# EAGLE design Integrated Board v1 (EAGLE 6.2)
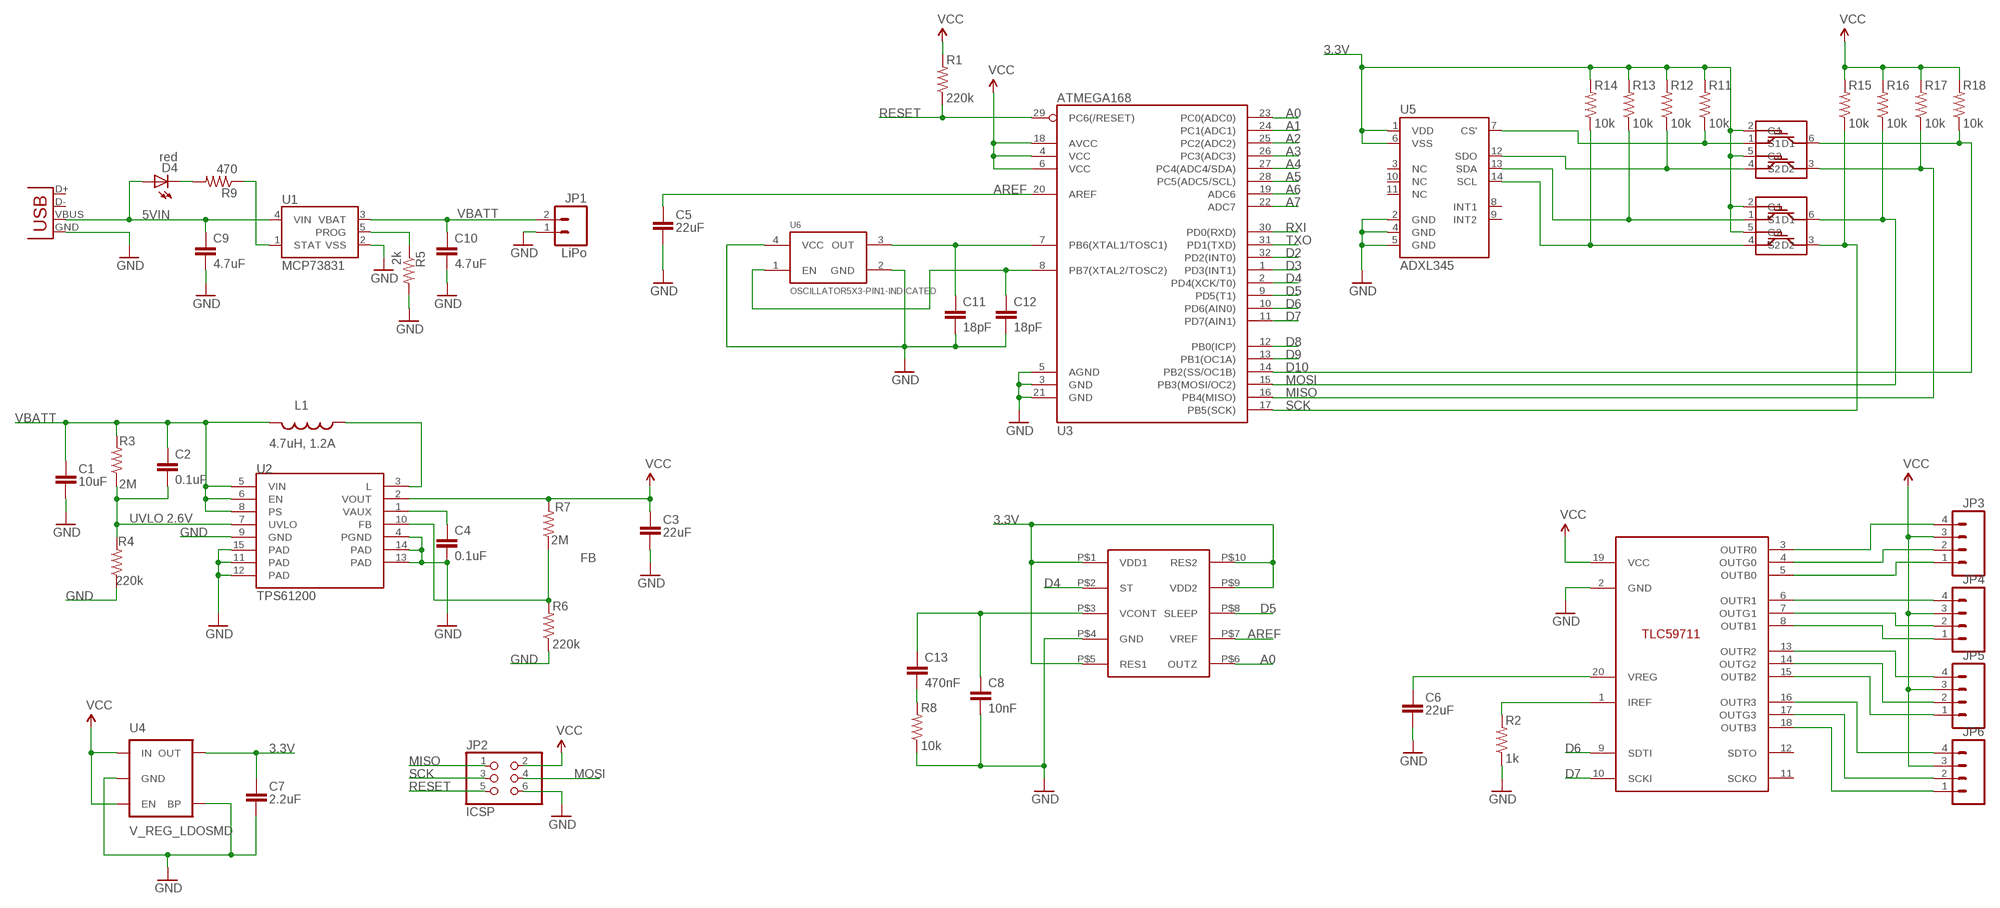
[diagram p0: schematic, sheet 1]

## Parts
C1  10uF  CAP0603  [0603]
C2  0.1uF  CAP0603-CAP  [0603-CAP]
C3  22uF  CAP0805  [0805]
C4  0.1uF  CAP0603-CAP  [0603-CAP]
C5  22uF  CAP0805  [0805]
C6  22uF  CAP0805  [0805]
C7  2.2uF  CAP0603  [0603]
C8  10nF  CAP0603-CAP  [0603-CAP]
C9  4.7uF  CAP0603-CAP  [0603-CAP]
C10  4.7uF  CAP0603-CAP  [0603-CAP]
C11  18pF  CAP0603-CAP  [0603-CAP]
C12  18pF  CAP0603-CAP  [0603-CAP]
C13  470nF  CAP0603-CAP  [0603-CAP]
D4  red  LED0603  [LED-0603]
JP1  LiPo  M02-JST-2MM-SMT  [JST-2-SMD]
JP2  ICSP  PINHD-2X3  [2X03]
JP3  M04PTH  [1X04]
JP4  M04PTH  [1X04]
JP5  M04PTH  [1X04]
JP6  M04PTH  [1X04]
L1  4.7uH, 1.2A  INDUCTOR.  [CDRH2D09]
R1  220k  RESISTOR0603-RES  [0603-RES]
R2  1k  RESISTOR0603-RES  [0603-RES]
R3  2M  RESISTOR0603-RES  [0603-RES]
R4  220k  RESISTOR0603-RES  [0603-RES]
R5  2k  RESISTOR0603-RES  [0603-RES]
R6  220k  RESISTOR0603-RES  [0603-RES]
R7  2M  RESISTOR0603-RES  [0603-RES]
R8  10k  RESISTOR0603-RES  [0603-RES]
R9  470  RESISTOR0603-RES  [0603-RES]
R11  10k  RESISTOR0603-RES  [0603-RES]
R12  10k  RESISTOR0603-RES  [0603-RES]
R13  10k  RESISTOR0603-RES  [0603-RES]
R14  10k  RESISTOR0603-RES  [0603-RES]
R15  10k  RESISTOR0603-RES  [0603-RES]
R16  10k  RESISTOR0603-RES  [0603-RES]
R17  10k  RESISTOR0603-RES  [0603-RES]
R18  10k  RESISTOR0603-RES  [0603-RES]
U1  MCP73831  [SOT23-5]
U2  TPS61200  [QFN-10_PAD]
U3  ATMEGA168  [TQFP32-08]
U4  V_REG_LDOSMD  [SOT23-5]
U5  ADXL345  [LGA14]
U6  OSCILLATOR5X3-PIN1-INDICATED  [CRYSTAL-OSC-SMD-5X3]
U$1  TLC59711  [TSSOP20]
U$2  2N7002DW  [SOT363]
U$3  2N7002DW  [SOT363]
U$4  LY3100ALH  [LGA10]
X1  USB-MICROB  [USB-MICROB]

## Nets
3.3V: C7.1 R11.2 R12.2 R13.2 R14.2 U4.5(OUT) U5.1(VDD) U5.6(VSS) U$2.2(G1) U$2.5(G2) U$3.2(G1) U$3.5(G2) U$4.P$1(VDD1) U$4.P$5(RES1) U$4.P$9(VDD2) U$4.P$10(RES2)
5VIN: C9.1 D4.A U1.4(VIN) X1.VBUS
A0: U3.23(PC0(ADC0)) U$4.P$6(OUTZ)
A1: U3.24(PC1(ADC1))
A2: U3.25(PC2(ADC2))
A3: U3.26(PC3(ADC3))
A4: U3.27(PC4(ADC4/SDA))
A5: U3.28(PC5(ADC5/SCL))
A6: U3.19(ADC6)
A7: U3.22(ADC7)
AREF: C5.1 U3.20(AREF) U$4.P$7(VREF)
D2: U3.32(PD2(INT0))
D3: U3.1(PD3(INT1))
D4: U3.2(PD4(XCK/T0)) U$4.P$2(ST)
D5: U3.9(PD5(T1)) U$4.P$8(SLEEP)
D6: U3.10(PD6(AIN0)) U$1.9(SDTI)
D7: U3.11(PD7(AIN1)) U$1.10(SCKI)
D8: U3.12(PB0(ICP))
D9: U3.13(PB1(OC1A))
D10: R18.1 U3.14(PB2(SS/OC1B)) U$2.6(D1)
FB: R6.2 R7.1 U2.10(FB)
GND: C1.2 C3.2 C4.2 C5.2 C6.2 C7.2 C8.2 C9.2 C10.2 C11.2 C12.2 JP1.1 JP2.6 R2.1 R4.1 R5.2 R6.1 R8.1 U1.2(VSS) U2.4(PGND) U2.9(GND) U2.11(PAD) U2.12(PAD) U2.13(PAD) U2.14(PAD) U2.15(PAD) U3.3(GND) U3.5(AGND) U3.21(GND) U4.2(GND) U4.4(BP) U5.2(GND) U5.4(GND) U5.5(GND) U6.2(GND) U6.4(VCC) U$1.2(GND) U$4.P$4(GND) X1.GND
MISO: JP2.1 R17.1 U3.16(PB4(MISO)) U$2.3(D2)
MOSI: JP2.4 R16.1 U3.15(PB3(MOSI/OC2)) U$3.6(D1)
N$1: C4.1 U2.1(VAUX)
N$2: L1.P$1 U2.3(L)
N$3: C11.1 U3.7(PB6(XTAL1/TOSC1)) U6.3(OUT)
N$5: C13.2 R8.2
N$6: C6.1 U$1.20(VREG)
N$7: R2.2 U$1.1(IREF)
N$8: D4.C R9.2
N$10: R11.1 U5.7(CS') U$2.1(S1)
N$11: R5.1 U1.5(PROG)
N$12: R12.1 U5.12(SDO) U$2.4(S2)
N$13: R13.1 U5.13(SDA) U$3.1(S1)
N$14: R9.1 U1.1(STAT)
N$15: R14.1 U5.14(SCL) U$3.4(S2)
N$16: JP4.4(B) U$1.6(OUTR1)
N$17: JP4.2(R) U$1.7(OUTG1)
N$18: JP4.1(COM) U$1.8(OUTB1)
N$19: JP5.4(B) U$1.13(OUTR2)
N$20: JP5.2(R) U$1.14(OUTG2)
N$21: JP5.1(COM) U$1.15(OUTB2)
N$22: JP6.4(B) U$1.16(OUTR3)
N$23: JP6.2(R) U$1.17(OUTG3)
N$24: JP6.1(COM) U$1.18(OUTB3)
N$25: JP3.1(COM) U$1.5(OUTB0)
N$26: JP3.2(R) U$1.4(OUTG0)
N$27: JP3.4(B) U$1.3(OUTR0)
N$28: C12.1 U3.8(PB7(XTAL2/TOSC2)) U6.1(EN)
N$30: C8.1 C13.1 U$4.P$3(VCONT)
RESET: JP2.5 R1.1 U3.29(PC6(/RESET))
RXI: U3.30(PD0(RXD))
SCK: JP2.3 R15.1 U3.17(PB5(SCK)) U$3.3(D2)
TXO: U3.31(PD1(TXD))
UVLO: C2.2 R3.1 R4.2 U2.7(UVLO)
VBATT: C1.1 C2.1 C10.1 JP1.2 L1.P$2 R3.2 U1.3(VBAT) U2.5(VIN) U2.6(EN) U2.8(PS)
VCC: C3.1 JP2.2 JP3.3(G) JP4.3(G) JP5.3(G) JP6.3(G) R1.2 R7.2 R15.2 R16.2 R17.2 R18.2 U2.2(VOUT) U3.4(VCC) U3.6(VCC) U3.18(AVCC) U4.1(IN) U4.3(EN) U$1.19(VCC)
Unconnected: U5.3(NC) U5.8(INT1) U5.9(INT2) U5.10(NC) U5.11(NC) U$1.11(SCKO) U$1.12(SDTO) X1.D+ X1.D-

## Notes on the sheet
- UVLO 2.6V

## Library data of the parts
C1 C3 C5-C7 = CH_passive:CAP: Capacitor Standard 0603 ceramic capacitor, and 0.1" leaded capacitor.
C2 C4 C8-C13 = SparkFun:CAP: Capacitor Standard 0603 ceramic capacitor, and 0.1" leaded capacitor.
D4 = SparkFun:LED: LEDs Standard schematic elements and footprints for 5mm, 3mm, 1206, and 0603 sized LEDs. 5mm - Spark Fun Electronics SKU : COM-00529 (and others)
JP1 = SparkFun:M02: Header 2 Standard 2-pin 0.1" header. Use with straight break away headers (SKU : PRT-00116), right angle break away headers (PRT-00553), swiss pins (PRT-00743), machine pins (PRT-00117), and female headers (PRT-00115). Molex polarized connector foot print use with SKU : PRT-08233 with associated crimp pins and housings.
JP2 = SparkFun:PINHD-2X3: PIN HEADER
JP3-JP6 = SparkFun:M04: Header 4 Standard 4-pin 0.1" header. Use with straight break away headers (SKU : PRT-00116), right angle break away headers (PRT-00553), swiss pins (PRT-00743), machine pins (PRT-00117), and female headers (PRT-00115). Molex polarized connector foot print use with SKU : PRT-08231 with associated crimp pins and housings. 1MM SMD Version SKU: PRT-10208
L1 = SparkFun:INDUCTOR: Inductors Basic Inductor/Choke - 0603 and 1206. Footprints are not proven and vary greatly between part numbers.
R1-R9 R11-R18 = SparkFun:RESISTOR: Resistor Basic schematic elements and footprints for 0603, 1206, and PTH resistors.
U1 = SparkFun:MCP73831: Microchip's MCP73831 Miniature single cell, fully integrated Li-Ion, Li-polymer charge management controller http://ww1.microchip.com/downloads/en/DeviceDoc/21984a.pdf
U2 = SparkFun:TPS61200: DC to DC Booster
U3 = SparkFun:ATMEGA168
U4 = SparkFun:V_REG_LDO: Voltage Regulator LDO Standard 150mA LDO voltage regulator in SOT-23 layout. Micrel part MIC5205. BP (by-pass) pin is used to lower output noise with 470pF cap.
U5 = SparkFun:ADXL345
U6 = SparkFun:OSCILLATOR
U$1 = SparkFun:TLC59711: TLC59711 RGB LED controller
U$2 U$3 = SparkFun:2N7002DW
U$4 = SparkFun:LY3100ALH
X1 = SparkFun:USB: USB Connectors USB-B-PTH is fully proven SKU : PRT-00139 USB-miniB is fully proven SKU : PRT-00587 USB-A-PCB is untested. USB-A-H is throughly reviewed, but untested. Spark Fun Electronics SKU : PRT-00437 USB-B-SMT is throughly reviewed, but untested. Needs silkscreen touching up. USB-A-S has not been used/tested USB-MB-H has not been used/tested

## Net classes
0 default: width 0.203 mm
1 vcc: width 0.254 mm

## Board
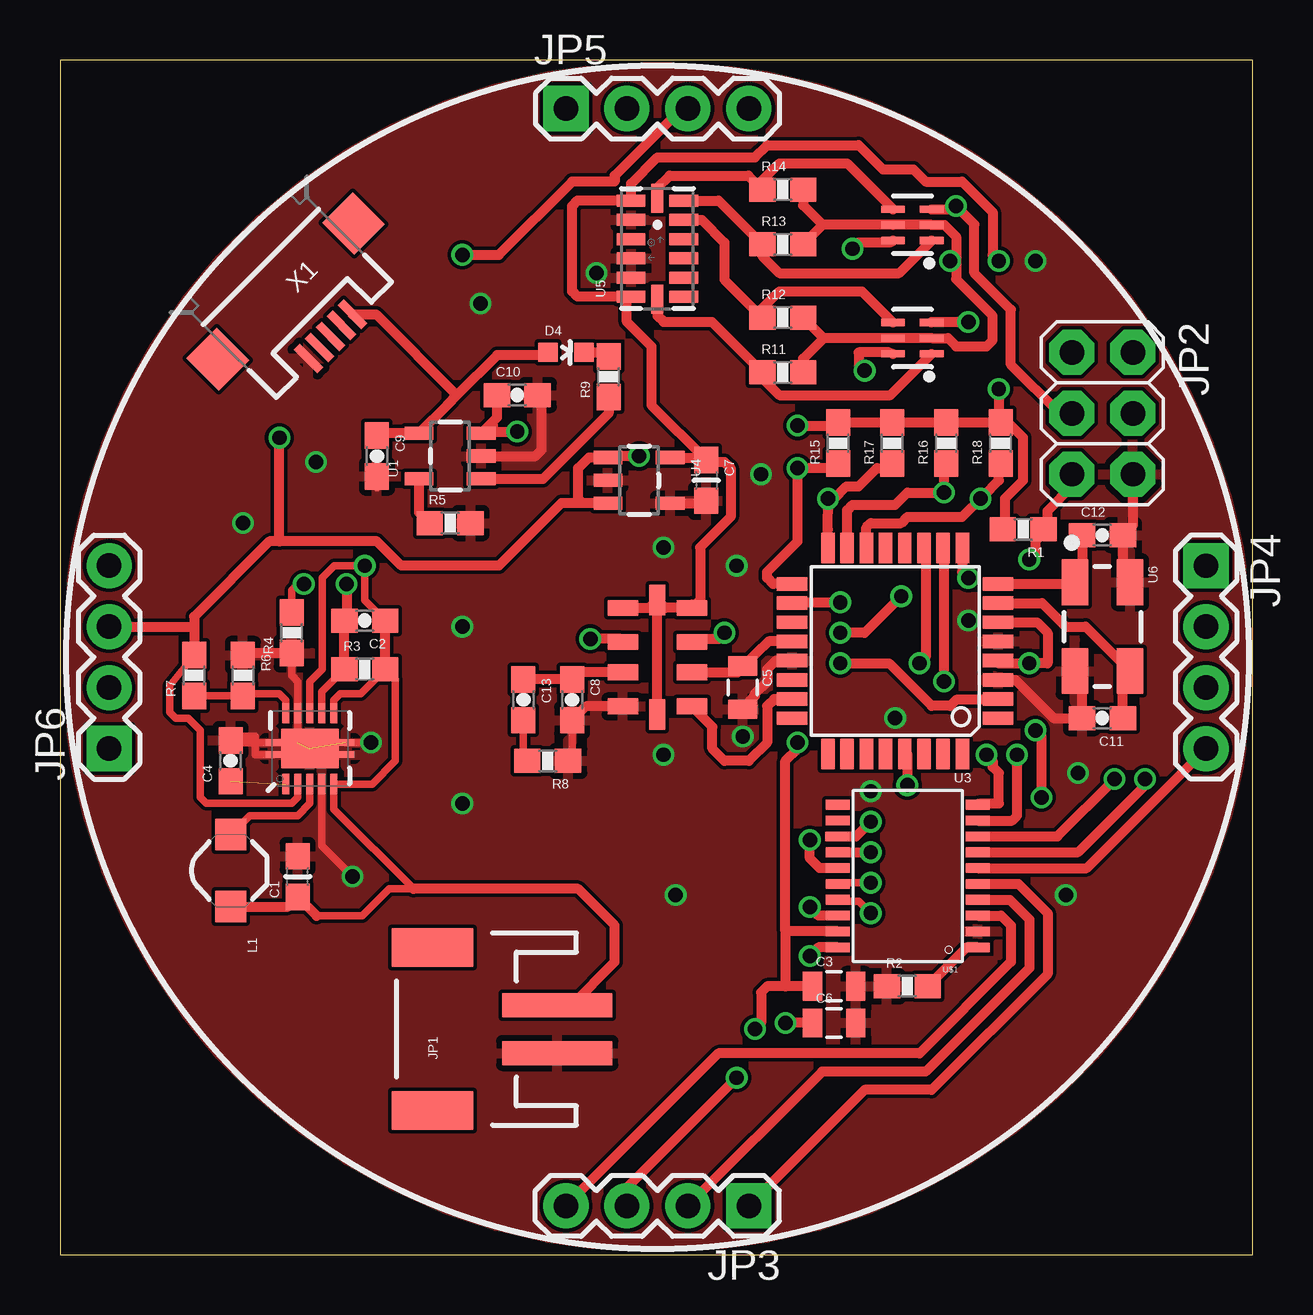
[diagram p1: board, top side]
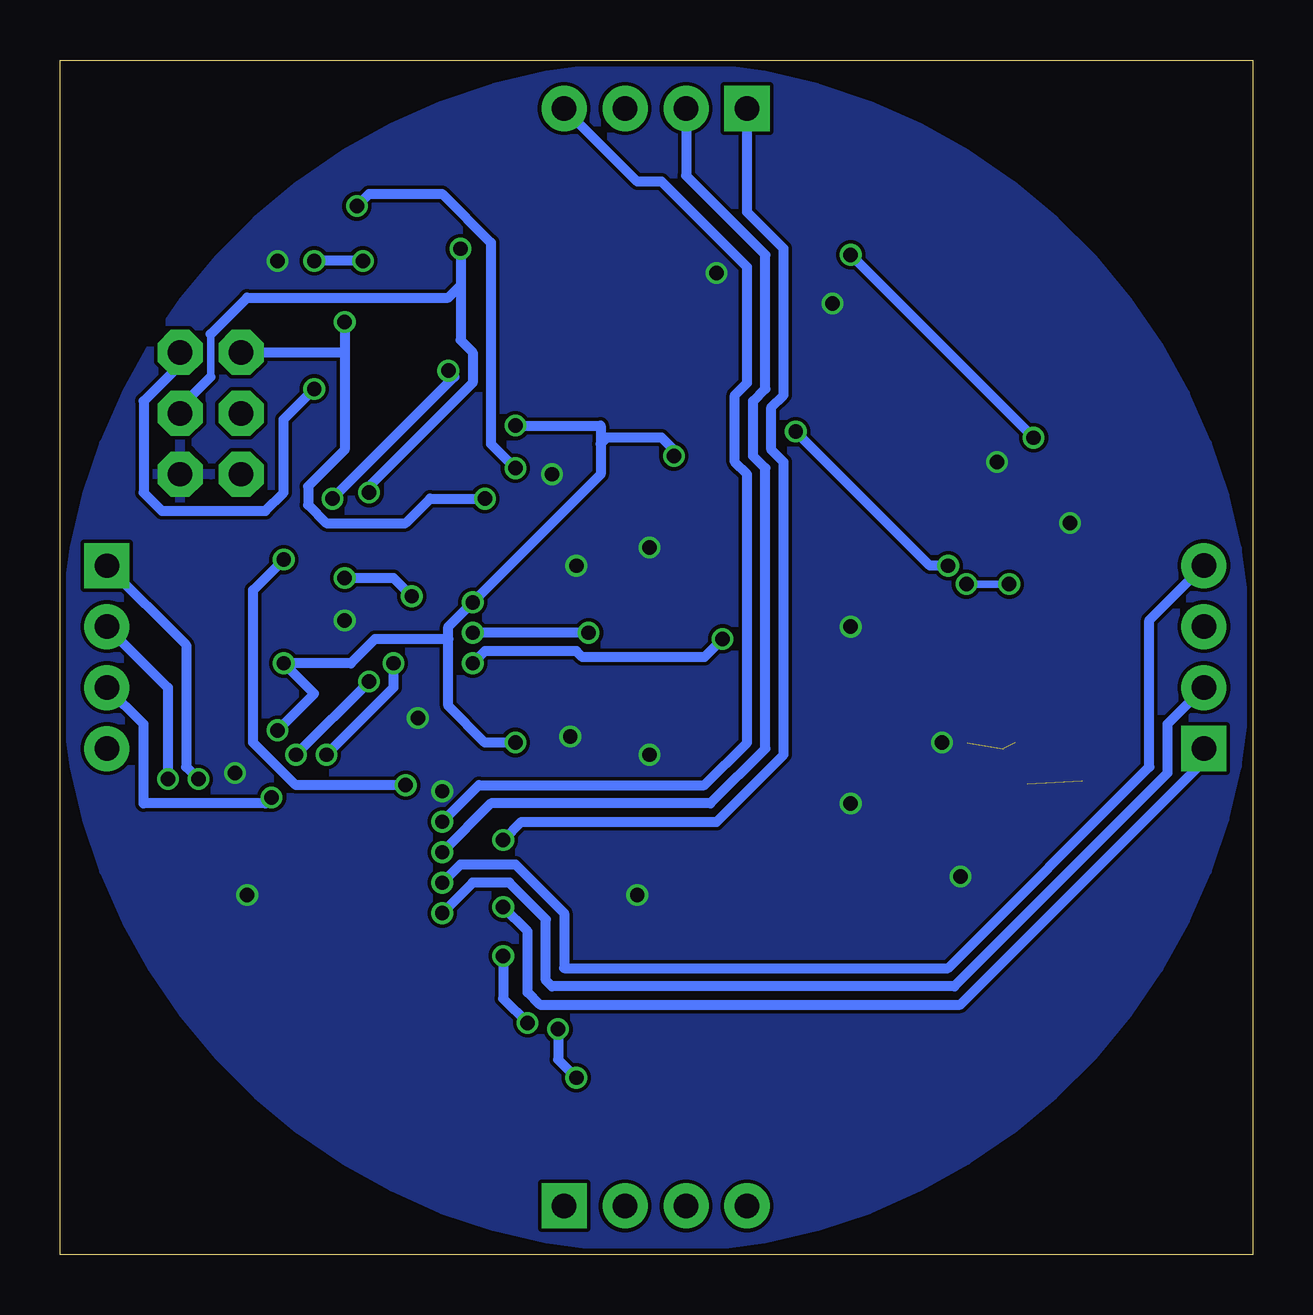
[diagram p2: board, bottom side, seen from below]

Size 49.71 x 49.77 mm. Coordinates in mm from the lower left corner, seen from the top.
Outline: 0,0 49.71,0 49.71,49.77 0,49.77 0,0
Copper layers (1*16): Top 0.035mm / dielectric 1.5mm / Bottom 0.035mm
Design rules: minimum track width 6mil, minimum drill 12mil, track to track 6mil, track to pad 6mil, pad to pad 6mil, via to via 6mil, smd to smd 0mil, copper to edge 10mil, drill to drill 10mil, minimum pad ring 10mil, minimum via ring 6mil, stop-mask expansion 2mil, vias tented up to drill 100mil, thermal gap 10mil

### Footprints (pad centres in the part's own frame; a part is rotated, then mirrored left to right if it is on the bottom)
0603 = smd 1.1 x 1: 1 -0.85,0; 2 0.85,0
0603-CAP = smd 1.1 x 1: 1 -0.85,0; 2 0.85,0
0805 = smd 0.8 x 1.2: 1 -0.9,0; 2 0.9,0
LED-0603 = smd 0.8 x 0.8: A 0,-0.75; C 0,0.75
JST-2-SMD = smd 1 x 4.6: 1 -1,-3.7; 2 1,-3.7 | smd 1.6 x 3.4: NC1 -3.4,1.5; NC2 3.4,1.5
2X03 = drill 1.016 pad 1.88 octagon: 1 -2.54,-1.27; 2 -2.54,1.27; 3 0,-1.27; 4 0,1.27; 5 2.54,-1.27; 6 2.54,1.27
1X04 = drill 1.016 pad 1.88 square: 1 0,0 | drill 1.016 pad 1.88: 2 2.54,0; 3 5.08,0; 4 7.62,0
CDRH2D09 = smd 1.3 x 1.3: P$1 -1.5,0; P$2 1.5,0
0603-RES = smd 1.1 x 1: 1 -0.85,0; 2 0.85,0
SOT23-5 = smd 0.55 x 1.2: 1 -0.95,-1.3; 2 0,-1.3; 3 0.95,-1.3; 4 0.95,1.3; 5 -0.95,1.3
QFN-10_PAD = smd 0.297 x 0.85: 1 -1,-1.475; 2 -0.5,-1.475; 3 0,-1.475; 4 0.5,-1.475; 5 1,-1.475; 6 1,1.475; 7 0.5,1.475; 8 0,1.475; 9 -0.5,1.475; 10 -1,1.475 | smd 0.7 x 0.28: 11 -1.5,0.25; 12 -1.5,-0.25; 13 1.5,0.25; 14 1.5,-0.25 | smd 2.4 x 1.65: 15 0,0
TQFP32-08 = smd 1.27 x 0.559: 1 -4.293,2.8; 2 -4.293,2; 3 -4.293,1.2; 4 -4.293,0.4; 5 -4.293,-0.4; 6 -4.293,-1.2; 7 -4.293,-2; 8 -4.293,-2.8; 17 4.293,-2.8; 18 4.293,-2; 19 4.293,-1.2; 20 4.293,-0.4; 21 4.293,0.4; 22 4.293,1.2; 23 4.293,2; 24 4.293,2.8 | smd 0.559 x 1.27: 9 -2.8,-4.293; 10 -2,-4.293; 11 -1.2,-4.293; 12 -0.4,-4.293; 13 0.4,-4.293; 14 1.2,-4.293; 15 2,-4.293; 16 2.8,-4.293; 25 2.8,4.293; 26 2,4.293; 27 1.2,4.293; 28 0.4,4.293; 29 -0.4,4.293; 30 -1.2,4.293; 31 -2,4.293; 32 -2.8,4.293
LGA14 = smd 0.5 x 1.2: 1 2,1.1; 2 1.2,1.1; 3 0.4,1.1; 4 -0.4,1.1; 5 -1.2,1.1; 6 -2,1.1; 8 -2,-1.1; 9 -1.2,-1.1; 10 -0.4,-1.1; 11 0.4,-1.1; 12 1.2,-1.1; 13 2,-1.1 | smd 1.2 x 0.5: 7 -2.1,0; 14 2.1,0
CRYSTAL-OSC-SMD-5X3 = smd 1.9 x 1.1: 1 -1.85,-1.15; 2 1.85,-1.15; 3 1.85,1.15; 4 -1.85,1.15
TSSOP20 = smd 1 x 0.4: 1 -2.937,2.693; 2 -2.937,2.032; 3 -2.937,1.372; 4 -2.937,0.712; 5 -2.937,0.051; 6 -2.937,-0.609; 7 -2.937,-1.27; 8 -2.943,-1.93; 9 -2.937,-2.59; 10 -2.937,-3.251; 11 2.905,-3.251; 12 2.905,-2.59; 13 2.911,-1.93; 14 2.905,-1.27; 15 2.905,-0.609; 16 2.905,0.051; 17 2.905,0.712; 18 2.905,1.372; 19 2.905,2.032; 20 2.905,2.693
SOT363 = smd 0.3 x 0.99: 1 -0.65,-0.8; 2 0,-0.8; 3 0.65,-0.8; 4 0.65,0.81; 5 0,0.81; 6 -0.65,0.81
LGA10 = smd 1.27 x 0.66: P$1 -1.435,2.05; P$2 -1.435,0.635; P$3 -1.435,-0.635; P$4 -1.435,-2.05; P$6 1.435,-2.05; P$7 1.435,-0.635; P$8 1.435,0.635; P$9 1.435,2.05 | smd 0.66 x 1.27: P$5 0,-2.385; P$10 0,2.385
USB-MICROB = smd 0.35 x 1.4: D+ 0,2.65; D- -0.65,2.65; GND 1.3,2.65; ID 0.65,2.65; VBUS -1.3,2.65 | smd 1.8 x 1.9: MT1 -4,0; MT2 4,0

### Placement (x,y rotation side)
C1  9.91,15.75 90 top
C2  12.7,26.42 180 top
C3  32.26,11.18 0 top
C4  7.11,20.57 90 top
C5  28.45,23.62 270 top
C6  32.26,9.65 0 top
C7  26.92,32.26 270 top
C8  21.34,23.11 270 top
C9  13.21,33.27 270 top
C10  19.05,35.81 0 top
C11  43.43,22.35 180 top
C12  43.43,29.97 0 top
C13  19.3,23.11 270 top
D4  21.08,37.59 270 top
JP1  17.02,9.4 90 top
JP2  43.43,35.05 270 top
JP3  28.7,2.03 180 top
JP4  47.75,28.7 270 top
JP5  21.08,47.75 0 top
JP6  2.04,21.09 90 top
L1  7.11,16 270 top
R1  40.13,30.23 180 top
R2  35.31,11.18 0 top
R3  12.7,24.38 0 top
R4  9.65,25.91 90 top
R5  16.26,30.48 0 top
R6  7.62,24.13 270 top
R7  5.59,24.13 90 top
R8  20.32,20.57 180 top
R9  22.86,36.58 90 top
R11  30.12,36.75 0 top
R12  30.12,39.04 0 top
R13  30.12,42.09 0 top
R14  30.12,44.37 0 top
R15  32.43,33.81 90 top
R16  36.93,33.81 90 top
R17  34.68,33.81 90 top
R18  39.19,33.81 90 top
U1  16.26,33.27 90 top
U2  10.41,21.08 0 top
U3  34.8,25.15 180 top
U4  24.13,32.26 270 top
U5  24.89,41.91 90 top
U6  43.43,26.16 270 top
U$1  35.31,15.49 180 top
U$2  35.52,38.18 90 top
U$3  35.52,42.9 90 top
U$4  24.89,24.89 0 top
X1  9.4,40.13 225 top

### Tracks (layer width: path | path; a pad name or v marks a point on that pad's centre or on a via)
3.3V  (via drill 0.6)
  Top 0.406: 31.78,42.9 U$3.5 U$3.2 36.85,42.9 37.34,42.42 37.34,41.4 | 31.78,42.9 R13.2 | R14.2 30.97,43.72 31.78,42.9 | 31.82,38.18 U$2.5 U$2.2 37,38.18 37.34,37.85 38.61,37.85 38.86,38.1 38.86,39.12 37.34,40.64 37.34,41.4 | 31.82,38.18 R12.2 | R11.2 30.97,37.33 31.82,38.18 | U$4.P$9 25.23,26.94 U$4.P$10 | U$4.P$1 24.56,26.94 U$4.P$10 | U$4.P$5 U$4.P$10 | U4.5 26.82,33.21 C7.1 | U$4.P$9 26.33,27.09 | C7.1 27.01,33.02 27.69,33.02 27.94,32.77 27.94,30.73 26.67,29.46 26.67,27.29 U$4.P$9 | v39.12,41.4 38.86,41.66 38.86,43.43 37.59,44.7 36.07,44.7 35.56,45.21 34.29,45.21 33.27,46.23 29.46,46.23 28.96,45.72 24.89,45.72 23.79,44.62 U5.1 21.56,43.91 21.34,43.69 21.34,40.13 21.56,39.91 U5.6 23.62,39.74 23.62,38.86 24.64,37.85 24.64,35.39 C7.1 | 37.34,41.4 v37.08,41.4
  Bottom 0.406: v37.08,41.4 v39.12,41.4
5VIN
  Top 0.406: 16.54,35.81 16.15,35.41 U1.4 13.31,34.22 C9.1 | D4.A 20.22,37.48 18.21,37.48 16.54,35.81 | X1.VBUS 13.17,39.18 16.54,35.81
A0
  Top 0.406: U3.23 29.75,23.15 29.46,22.86 29.46,21.34 28.7,20.57 27.69,20.57 27.18,21.08 27.18,21.99 U$4.P$6
AREF
  Top 0.406: U$4.P$7 28.23,24.26 C5.1 29.52,25.55 U3.20
D4  (via drill 0.6)
  Top 0.406: U3.2 38.86,23.11 37.34,23.11 37.08,22.86 36.32,22.86 34.54,24.64 v32.51,24.64 | v22.1,25.65 23.37,25.65 U$4.P$2
  Bottom 0.406: v32.51,24.64 32,25.15 28.19,25.15 27.94,24.89 22.86,24.89 v22.1,25.65
D5  (via drill 0.6)
  Top 0.406: v32.51,25.91 33.53,25.91 v35.05,27.43 | v37.85,28.19 37.59,28.45 37.59,29.21 U3.9 | v27.69,25.91 27.43,25.65 26.42,25.65 U$4.P$8
  Bottom 0.406: v35.05,27.43 35.81,28.19 v37.85,28.19 | v27.69,25.91 v32.51,25.91
D6  (via drill 0.6)
  Top 0.406: U3.10 36.83,29.21 v36.83,23.88 | U$1.9 39.67,18.08 39.88,18.29 v39.88,20.83
  Bottom 0.406: v36.83,23.88 v39.88,20.83
D7  (via drill 0.6)
  Top 0.406: U$1.10 38.35,18.8 39.12,18.8 39.12,20.07 38.86,20.32 38.86,20.57 v38.61,20.83 | U3.11 36.07,29.21 36.07,24.89 v35.81,24.64
  Bottom 0.406: v38.61,20.83 35.81,23.62 v35.81,24.64
D10  (via drill 0.6)
  Top 0.406: U$2.6 34.54,37.59 33.27,37.59 33.27,36.83 v33.53,36.83 | 39.38,32.77 R18.1 39.12,32.89 39.12,32.26 38.48,31.62 | 38.48,31.62 37.59,30.73 35.31,30.73 35.05,30.48 33.78,30.48 33.6,30.3 U3.14 | v38.35,31.5 38.35,31.75 38.48,31.62
  Bottom 0.406: v38.35,31.5 33.27,36.58 v33.53,36.83
FB
  Top 0.305: R7.1 R6.2 7.71,23.37 9.14,23.37 9.41,23.1 U2.10
GND  (via drill 0.6)  (2 unrouted)
  Top 0.305: C8.2 21.34,20.74 R8.1 | 13.21,32 12.95,32 | 9.91,24.8 R4.1 | 9.57,24.98 R4.1 | U2.11 8.13,21.33 8.13,21.34 | 8.13,21.34 7.11,21.34 C4.2 7.11,21.59 8.13,21.59 8.13,20.83 U2.12 | 8.13,21.34 9.91,21.34 U2.9 9.91,23.87 9.65,24.13 R4.1 | U2.13 v12.95,21.33 v12.95,21.34 | U2.4 10.91,17.03 v12.19,15.75
  Top 0.406: U$4.P$4 21.91,22.84 C8.2 | U6.4 44.28,28.31 C12.2 44.7,30.39 JP2.6 | U6.2 42.58,24.01 C11.2 41.4,22.35 39.81,23.95 U3.3 | C7.2 26.82,31.31 U4.4 25.91,31.24 | U1.2 19.81,33.27 20.07,33.53 20.07,35.65 C10.2 | R5.2 16.76,30.48 | 29.83,24.75 29.46,24.38 29.46,23.88 28.96,23.37 28.96,23.28 C5.2 | 13.21,32.51 C9.2 13.21,32 | R4.1 7.7,25.06 R6.1
  other vias: 33.78,19.3 28.45,21.59 25.15,20.83 25.65,14.99 16.76,18.8 16.76,26.16 25.15,29.46 17.53,39.62 22.35,40.89 37.85,26.42 34.8,22.35 10.67,33.02 42.42,20.07 28.19,28.7 40.64,41.4 41.91,14.99 7.62,30.48 29.21,32.51
  pour Top: 0.25,24.89 arc-90 24.89,49.53 arc-90 49.53,24.89 arc-90 24.89,0.25 arc-90
  pour Bottom: 0.25,24.89 arc-90 24.89,49.53 arc-90 49.53,24.89 arc-90 24.89,0.25 arc-90
MISO  (via drill 0.6)
  Top 0.406: 34.8,32.77 R17.1 34.48,32.77 34.04,32.77 33.27,32 32.77,32 32.26,31.5 v32,31.5 32,30.22 U3.16 | v37.85,38.86 36.32,38.86 U$2.3
  Bottom 0.406: v32,31.5 34.29,31.5 35.31,30.48 38.61,30.48 39.37,31.24 39.37,32 37.85,33.53 37.85,37.59 | v37.85,38.86 37.85,37.59 | JP2.1 37.85,37.59
MOSI  (via drill 0.6)
  Top 0.406: U$3.6 34.54,42.16 33.27,42.16 v33.02,41.91 33.02,41.66 | R16.1 36.83,32.77 v36.83,31.75 35.31,31.75 34.8,31.24 33.02,31.24 32.8,31.02 U3.15
  Bottom 0.305: JP2.4 44.7,35.31 | 43.43,36.58 43.43,38.35
  Bottom 0.406: v33.02,41.91 33.02,40.39 | 33.02,40.39 33.02,38.1 32.51,37.59 32.51,36.32 36.83,32 v36.83,31.75 | 44.7,35.31 43.43,36.58 | 43.43,38.35 41.91,39.88 33.53,39.88 33.02,40.39
N$1  (1 unrouted)
N$2
  Top 0.305: U2.3 10.41,18.8 9.91,18.29 7.9,18.29 L1.P$1
N$3
  Top 0.406: U3.7 40.93,27.15 41.91,26.16 42.73,26.16 U6.3 44.28,24.01 C11.1
N$5
  Top 0.305: C13.2 19.3,20.74 R8.2
N$6  (via drill 0.6)
  Top 0.406: U$1.20 31.6,12.8 v31.24,12.45 | C6.1 v30.23,9.65
  Bottom 0.406: v31.24,12.45 31.24,10.67 v30.23,9.65
N$7
  Top 0.406: U$1.1 37.78,12.8 R2.2
N$8
  Top 0.406: D4.C 22.95,37.59 R9.2
N$10
  Top 0.406: U$2.1 34.6,35.81 29.97,35.81 29.27,36.52 R11.1 27.16,38.86 25.15,38.86 24.89,39.12 U5.7
N$11
  Top 0.406: U1.5 14.96,30.93 R5.1
N$12
  Top 0.406: U$2.4 33.41,40.13 29.97,40.13 29.27,39.43 R12.1 27.69,40.62 27.69,42.16 26.74,43.11 U5.12
N$13
  Top 0.406: U5.13 27.45,43.91 R13.1 29.27,41.6 29.97,40.89 34.96,40.89 U$3.1
N$14
  Top 0.406: U1.1 20.13,32.32 22.86,35.05 R9.1
N$15
  Top 0.406: U5.14 24.89,44.45 25.4,44.96 28.68,44.96 R14.1 29.27,44.76 29.97,45.47 32.8,45.47 U$3.4
N$16
  Top 0.406: U$1.6 42.77,16.1 JP4.4
N$17  (via drill 0.6)
  Top 0.406: U$1.7 38.35,16.76 42.42,16.76 45.21,19.56 v45.21,19.81
  Bottom 0.406: JP4.2 45.21,23.62 v45.21,19.81
N$18  (via drill 0.6)
  Top 0.406: U$1.8 41.55,17.42 v43.94,19.81
  Bottom 0.406: JP4.1 44.45,25.4 44.45,20.32 v43.94,19.81
N$19  (via drill 0.6)
  Top 0.406: v33.78,18.03 33.17,17.42 U$1.13
  Bottom 0.406: v33.78,18.03 32.26,19.56 22.86,19.56 21.08,21.34 21.08,32.51 21.59,33.02 21.59,35.81 21.08,36.32 21.08,41.15 24.64,44.7 25.65,44.7 JP5.4
N$20  (via drill 0.6)
  Top 0.406: v33.78,16.76 32.51,16.76 U$1.14
  Bottom 0.406: JP5.2 23.62,44.96 20.32,41.66 20.32,36.07 20.83,35.56 20.83,33.27 20.32,32.77 20.32,21.08 22.61,18.8 31.75,18.8 v33.78,16.76
N$21  (via drill 0.6)
  Top 0.406: U$1.15 31.65,16.1 31.24,16.51 v31.24,17.27
  Bottom 0.406: v31.24,17.27 30.48,18.03 22.35,18.03 19.56,20.83 19.56,33.02 20.07,33.53 20.07,35.31 19.56,35.81 19.56,41.91 21.08,43.43 JP5.1
N$22  (via drill 0.6)
  Top 0.305: U$1.16 32.51,15.49 v33.78,15.49
  Bottom 0.406: v33.78,15.49 33.02,16.26 30.73,16.26 28.7,14.22 28.7,11.94 12.7,11.94 4.32,20.32 4.32,26.43 JP6.4
N$23  (via drill 0.6)
  Top 0.305: U$1.17 32.51,14.73 33.27,14.73 v33.78,14.22
  Bottom 0.406: v33.78,14.22 32.51,15.49 30.99,15.49 29.46,13.97 29.46,11.43 29.21,11.18 12.45,11.18 3.56,20.07 3.56,22.11 JP6.2
N$24  (via drill 0.6)
  Top 0.406: U$1.18 31.6,14.12 v31.24,14.48
  Bottom 0.305: v31.24,14.48 31.24,14.22
  Bottom 0.406: v31.24,14.48 30.23,13.46 30.23,10.92 29.72,10.41 12.19,10.41 2.04,20.56 JP6.1
N$25
  Top 0.406: JP3.1 33.53,6.86 36.32,6.86 41.15,11.68 41.15,14.22 39.93,15.44 U$1.5
N$26
  Top 0.406: JP3.2 31.75,7.62 36.07,7.62 40.39,11.94 40.39,13.97 39.57,14.78 U$1.4
N$27
  Top 0.406: JP3.4 27.43,8.38 35.81,8.38 39.62,12.19 39.62,13.72 39.22,14.12 U$1.3
N$28
  Top 0.406: U3.8 42.22,27.95 U6.1 42.58,28.31 C12.1
N$30
  Top 0.406: C13.1 C8.1 21.63,24.26 U$4.P$3
RESET  (via drill 0.6)
  Top 0.406: JP2.5 42.16,32 41.15,30.99 41.15,30.23 R1.1 40.89,30.23 40.89,29.97 40.64,29.72 40.64,28.96 40.39,28.7 v40.39,28.96 | v35.31,19.56 35.31,20.83 U3.29
  Bottom 0.406: v40.39,28.96 41.66,27.69 41.66,21.34 39.88,19.56 v35.31,19.56
SCK  (via drill 0.6)
  Top 0.406: R15.1 32.26,32.77 v30.73,32.77 30.73,29.72 29.46,28.45 29.46,28.19 29.72,27.94 29.72,27.95 U3.17 | U$3.3 37.22,43.55 v37.34,43.69 38.1,42.93 38.1,40.89 39.62,39.37 39.62,37.08 41.66,35.05 JP2.3
  Bottom 0.406: v30.73,32.77 31.75,33.78 31.75,42.16 33.78,44.2 36.83,44.2 v37.34,43.69
UVLO  (via drill 0.6)
  Top 0.305: R3.1 10.91,23.45 U2.7 | v10.16,27.94 9.91,27.94 9.65,27.69 R4.2
  Top 0.406: R3.1 C2.2 11.94,26.5 v11.94,27.94
  Bottom 0.305: v10.16,27.94 v11.94,27.94
VBATT  (via drill 0.6)
  Top 0.305: U2.6 11.41,23.1 11.68,23.37 12.53,23.37 R3.2 13.97,23.96 13.97,20.57 13,19.61 U2.5 11.41,18.56 14.73,15.24 13.72,15.24 12.59,14.11 10.69,14.11 | C2.1 12.7,27.27 v12.7,28.7 11.43,28.7 10.92,28.19 10.92,24.38 10.41,23.88 U2.8
  Top 0.406: R3.2 C2.1 | C10.1 18.2,34.87 17.95,34.62 | 17.95,34.62 U1.3 | 10.69,14.11 C1.1 9.51,14.5 L1.P$2 | 17.95,34.62 18.03,34.54 18.03,34.29 v19.05,34.29 | JP1.2 21.32,10.4 23.11,12.19 23.11,13.72 21.59,15.24 14.73,15.24
  Bottom 0.406: v19.05,34.29 13.46,28.7 v12.7,28.7
VCC  (via drill 0.6)
  Top 0.305: U2.2 9.91,19.06 9.65,18.8 6.1,18.8 5.84,19.05 5.84,21.84 5.33,22.35 4.83,22.35 4.57,22.61 4.57,23.71 R7.2
  Top 0.406: R18.2 R16.2 R17.2 R15.2 | 21.78,31.31 U4.3 22.86,31.24 | 21.78,31.31 21.59,31.5 21.59,32.77 22.03,33.21 U4.1 22.9,33.27 v24.13,33.27 | 21.78,31.31 20.89,31.31 18.29,28.7 14.22,28.7 13.21,29.72 9.14,29.72 | 32.51,34.8 R15.2 | v30.73,34.54 32.31,34.54 R15.2 | U3.4 39.12,24.64 v40.39,24.64 41.15,24.64 41.15,25.91 40.71,26.35 U3.6 | U3.18 30.73,27.18 32.26,27.18 32.51,27.43 v32.51,27.18 | 30.23,13.46 30.23,11.18 | C3.1 30.23,11.18 | 30.23,13.46 32.26,13.46 U$1.19 30.23,13.46 | 5.59,26.16 5.59,26.58 8.72,29.72 9.14,29.72 | 5.59,26.16 R7.2 | JP6.3 5.58,26.16 5.59,26.16 | R18.2 39.37,34.8 40.13,34.04 40.13,32.26 39.37,31.5 39.37,30.23 R1.2 | JP5.3 25.91,47.75 23.11,44.96 23.11,44.7 21.34,44.7 18.29,41.66 v16.76,41.66 | v39.12,36.07 39.12,34.73 R18.2 | 30.23,13.46 | 30.23,13.46 30.23,20.57 30.73,21.08 v30.73,21.34 | v28.96,9.4 29.21,9.65 29.21,10.92 29.46,11.18 30.23,11.18 | JP3.3 23.62,2.79 v28.19,7.37 | v40.89,19.05 40.89,21.59 v40.64,21.84 | 9.14,29.72 v9.14,34.04
  Bottom 0.406: v30.73,34.54 27.18,34.54 27.18,33.78 | 27.18,33.78 27.18,32.51 v32.51,27.18 33.53,26.16 33.53,25.65 | v24.13,33.27 24.13,33.53 24.64,34.04 26.92,34.04 27.18,33.78 | JP2.2 44.7,37.08 46.23,35.56 46.23,31.75 45.47,30.99 41.15,30.99 40.39,31.75 40.39,34.8 v39.12,36.07 | v30.73,21.34 32,21.34 33.53,22.86 33.53,25.65 | v28.19,7.37 28.96,8.13 v28.96,9.4 | v40.64,21.84 39.12,23.37 v40.39,24.64 37.59,24.64 36.58,25.65 33.53,25.65 | JP4.3 46.23,22.1 46.23,18.8 41.15,18.8 v40.89,19.05 | v16.76,41.66 v9.14,34.04